# EasyEDA Pro project ProProject_OSC1_2025-01-07.epro, schematic 按键电路
Create Date: 2024-12-06; Page Name: P1; Project Name: OSC1; Schematic Name: 按键电路; Update Date: 2024-12-06; Company: 嘉立创EDA; Page Size: A4; Version: V1.0
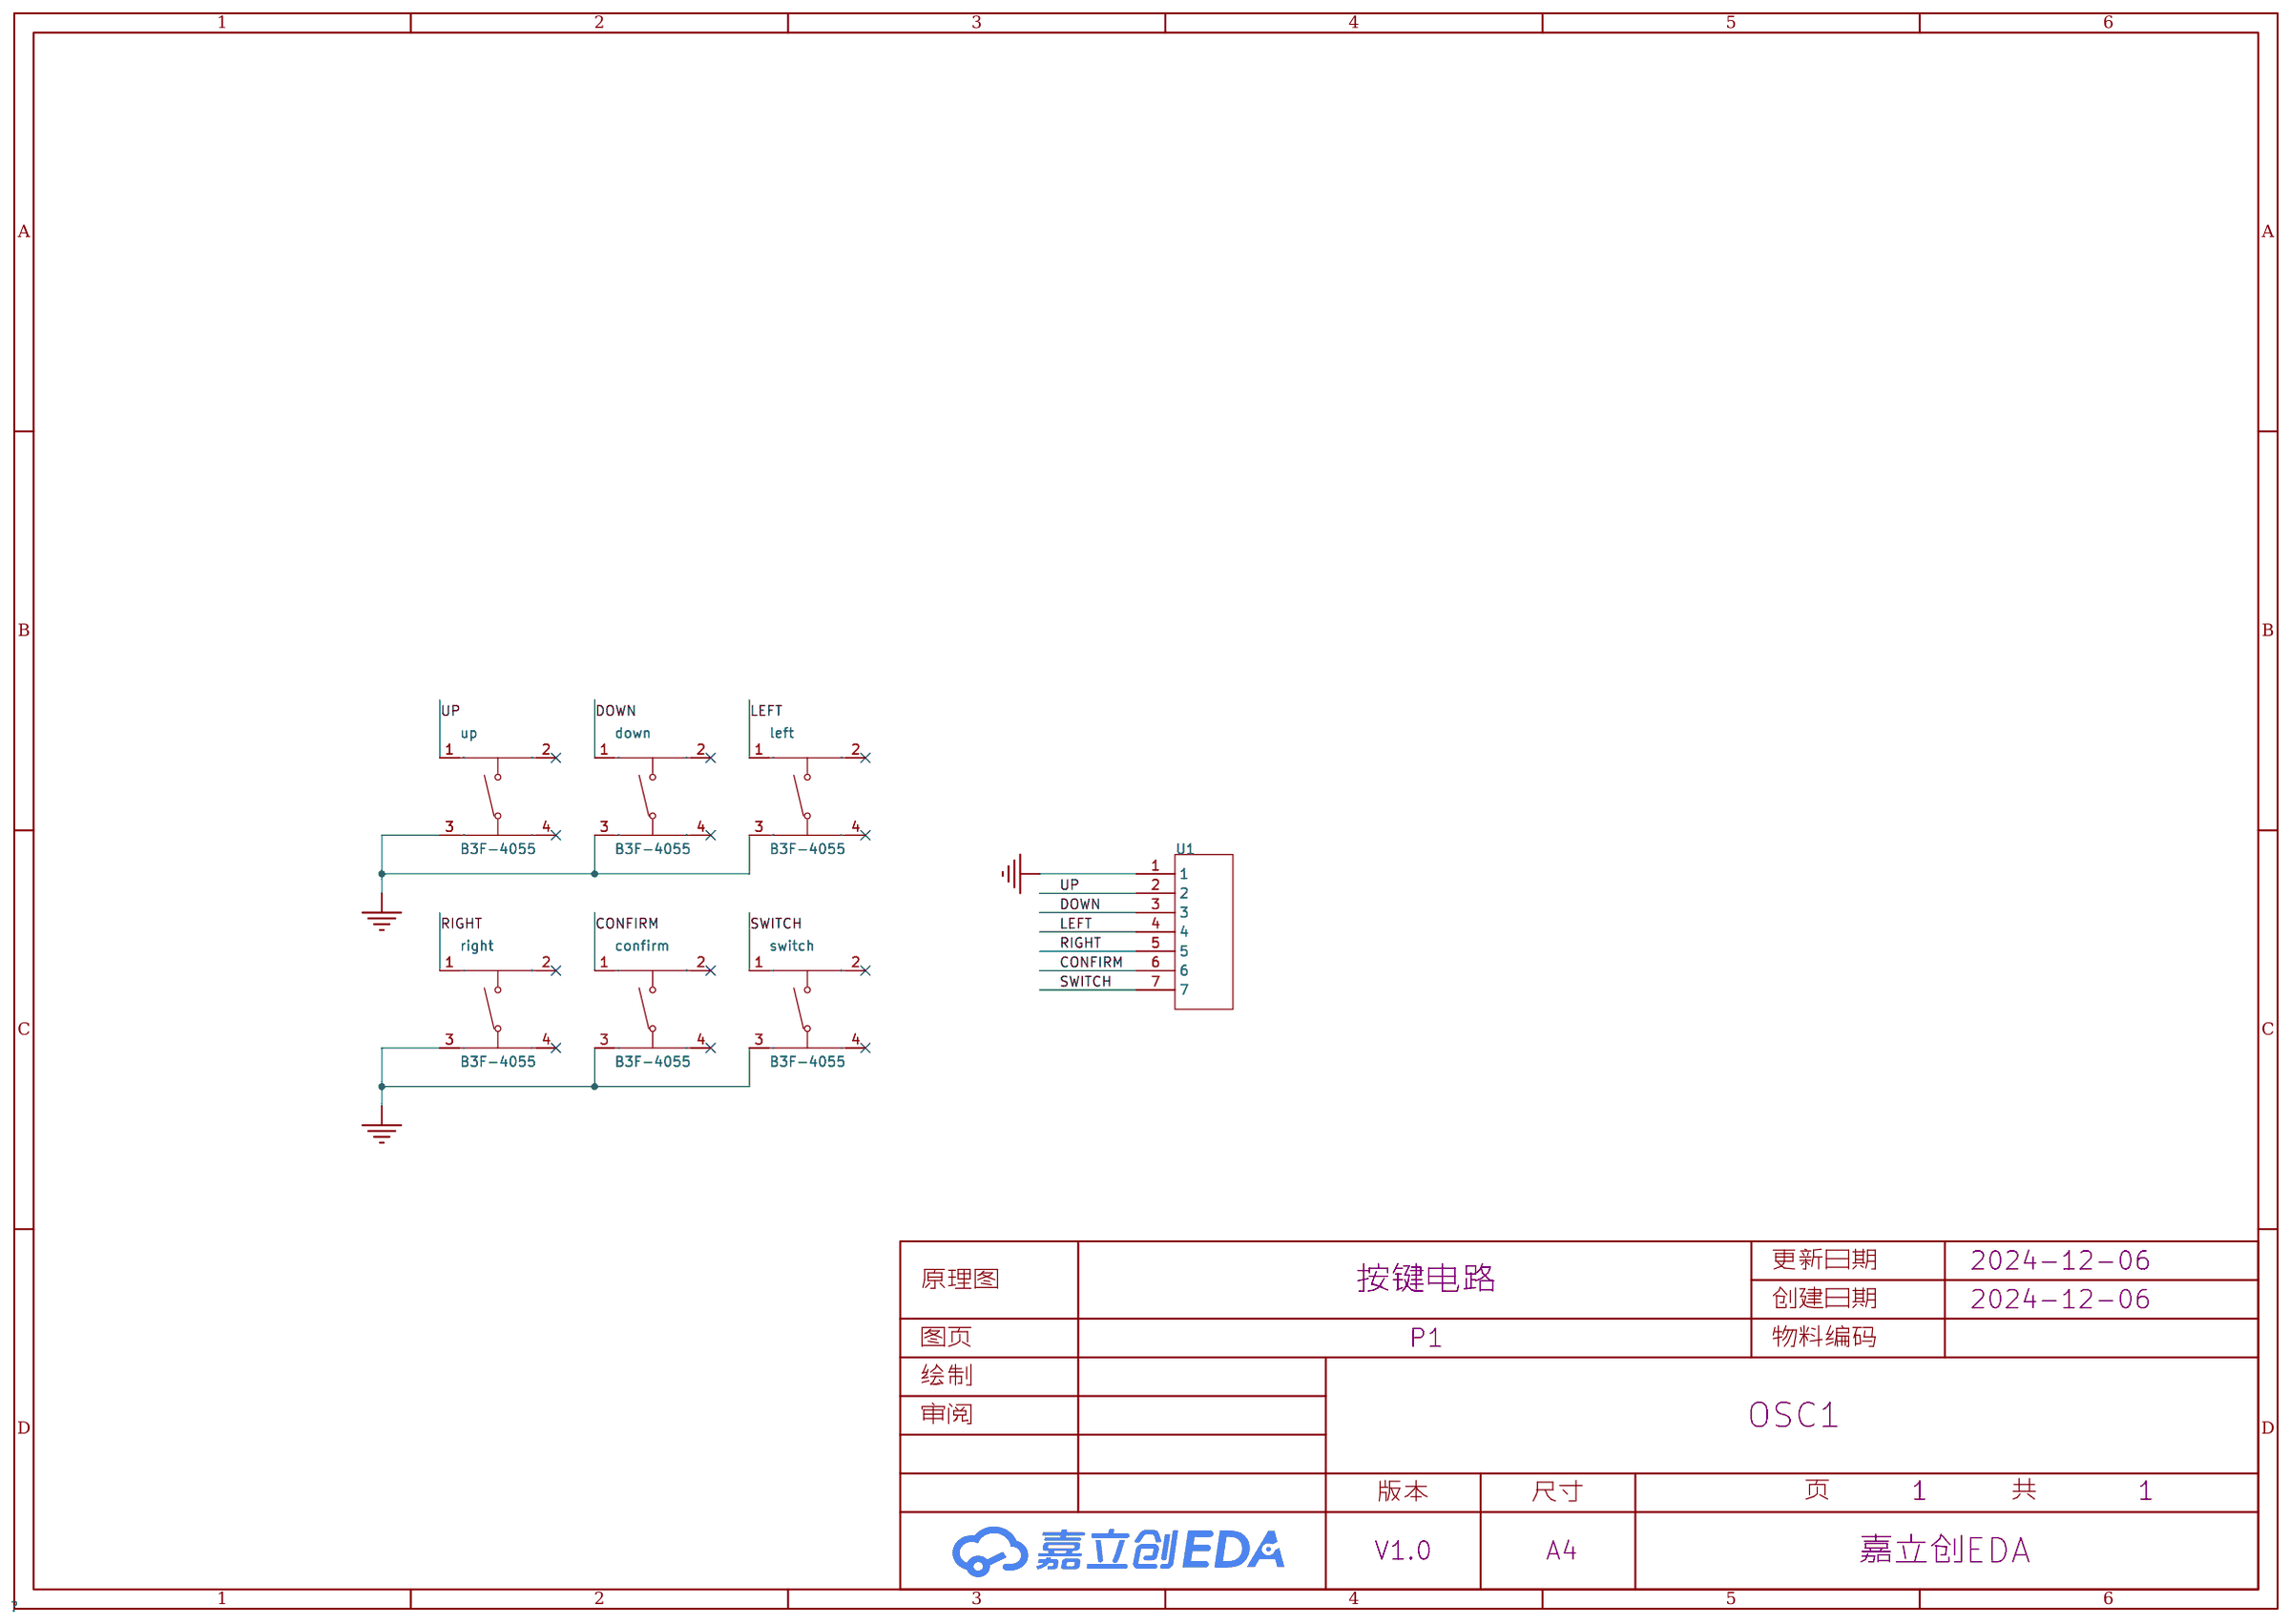
[diagram p7: schematic sheet]

## Parts
confirm  B3F-4055  [B3f]
down  B3F-4055  [B3f]
left  B3F-4055  [B3f]
right  B3F-4055  [B3f]
switch  B3F-4055  [B3f]
U1  -  [CH2.54-7插座]
up  B3F-4055  [B3f]

## Library data of the parts
confirm down left right switch up = B3F-4055: Supplier Part: C9900023790; Supplier Footprint: B3F-4055轻触开关4脚按键12*12*6; JLCPCB Part Class: 扩展库; Supplier: LCSC
U1 = HDR-7P

## Nets
GND: confirm.3 down.3 left.3 right.3 switch.3 U1.1 up.3
CONFIRM: confirm.1 U1.6
DOWN: down.1 U1.3
LEFT: left.1 U1.4
RIGHT: right.1 U1.5
SWITCH: switch.1 U1.7
UP: U1.2 up.1

Not connected (* = marked no-connect by the designer): confirm 2* 4*; down 2* 4*; left 2* 4*; right 2* 4*; switch 2* 4*; up 2* 4*
